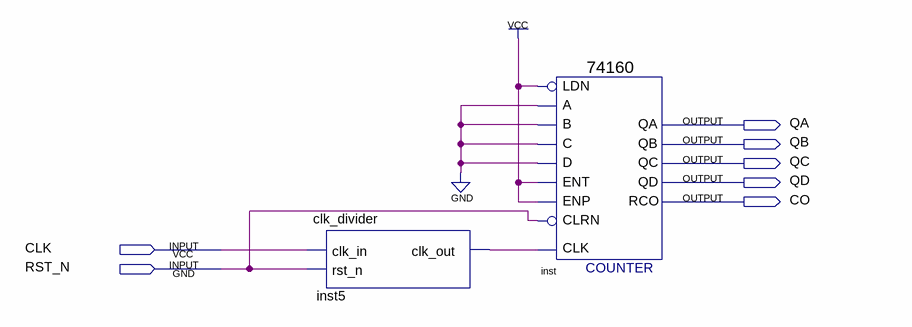
[diagram p0: schematic sheet]
// Quartus schematic M10.bdf as structural Verilog: 2 symbols, 7 pins
module M10 (
  input  CLK,
  input  RST_N,
  output QA,
  output QB,
  output QC,
  output QD,
  output CO
);

  wire inst5_clk_out;

  clk_divider inst5 (.clk_in(CLK), .rst_n(RST_N), .clk_out(inst5_clk_out));
  \74160  inst (
    .CLK(inst5_clk_out), .ENT(1'b1), .A(1'b0), .B(1'b0), .C(1'b0), .D(1'b0), .LDN(1'b1), .ENP(1'b1),
    .CLRN(RST_N), .QD(QD), .QA(QA), .QB(QB), .QC(QC), .RCO(CO));
endmodule
